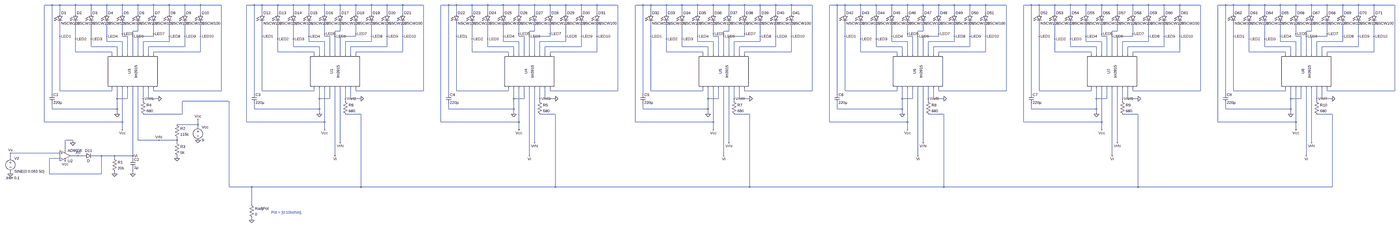
[diagram p0: schematic LM3915_Chain_Adj_Ground.asc, whole sheet]
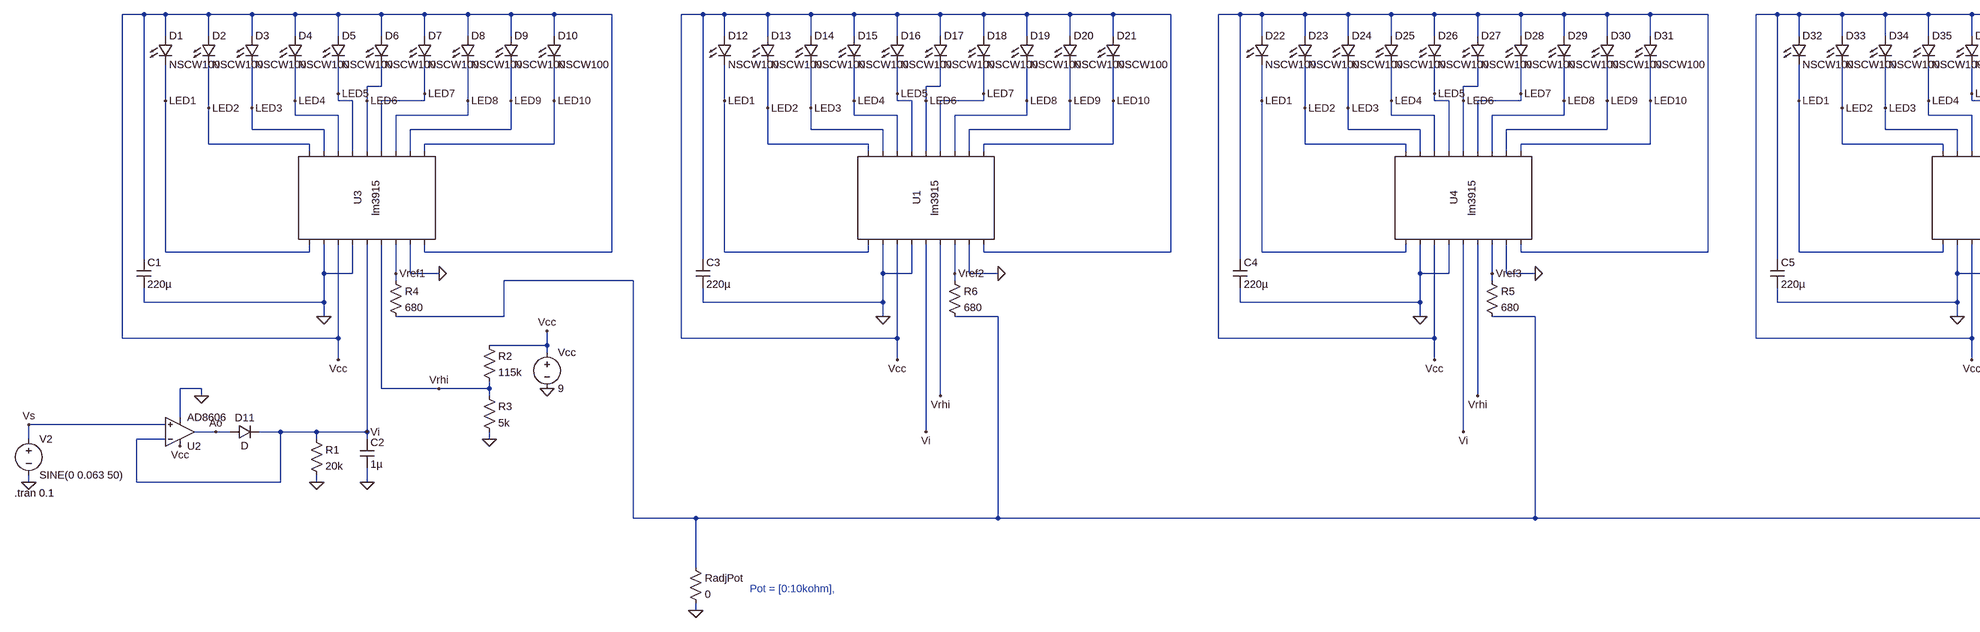
[diagram p1: schematic LM3915_Chain_Adj_Ground.asc, part, row 1 of 1, column 1 of 2]
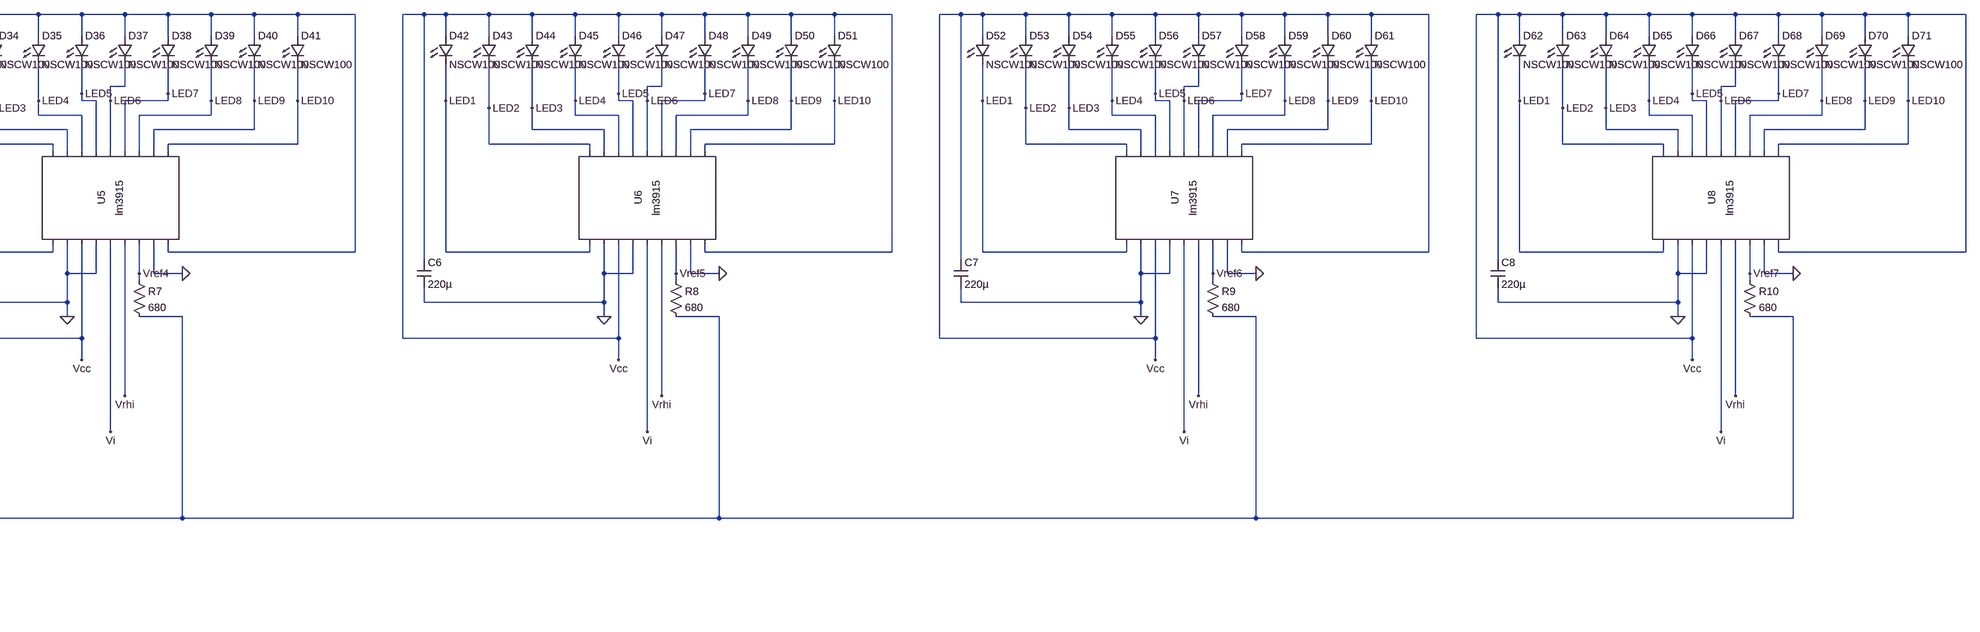
[diagram p2: schematic LM3915_Chain_Adj_Ground.asc, part, row 1 of 1, column 2 of 2]
LM3915_Chain_Adj_Ground.asc, the LTspice schematic file:
Version 4
SHEET 1 8612 680
WIRE -192 -832 -240 -832
WIRE -144 -832 -192 -832
WIRE -48 -832 -144 -832
WIRE 48 -832 -48 -832
WIRE 144 -832 48 -832
WIRE 240 -832 144 -832
WIRE 336 -832 240 -832
WIRE 432 -832 336 -832
WIRE 528 -832 432 -832
WIRE 624 -832 528 -832
WIRE 720 -832 624 -832
WIRE 848 -832 720 -832
WIRE 1104 -832 1056 -832
WIRE 1152 -832 1104 -832
WIRE 1248 -832 1152 -832
WIRE 1344 -832 1248 -832
WIRE 1440 -832 1344 -832
WIRE 1536 -832 1440 -832
WIRE 1632 -832 1536 -832
WIRE 1728 -832 1632 -832
WIRE 1824 -832 1728 -832
WIRE 1920 -832 1824 -832
WIRE 2016 -832 1920 -832
WIRE 2144 -832 2016 -832
WIRE 2400 -832 2352 -832
WIRE 2448 -832 2400 -832
WIRE 2544 -832 2448 -832
WIRE 2640 -832 2544 -832
WIRE 2736 -832 2640 -832
WIRE 2832 -832 2736 -832
WIRE 2928 -832 2832 -832
WIRE 3024 -832 2928 -832
WIRE 3120 -832 3024 -832
WIRE 3216 -832 3120 -832
WIRE 3312 -832 3216 -832
WIRE 3440 -832 3312 -832
WIRE 3696 -832 3648 -832
WIRE 3744 -832 3696 -832
WIRE 3840 -832 3744 -832
WIRE 3936 -832 3840 -832
WIRE 4032 -832 3936 -832
WIRE 4128 -832 4032 -832
WIRE 4224 -832 4128 -832
WIRE 4320 -832 4224 -832
WIRE 4416 -832 4320 -832
WIRE 4512 -832 4416 -832
WIRE 4608 -832 4512 -832
WIRE 4736 -832 4608 -832
WIRE 4976 -832 4928 -832
WIRE 5024 -832 4976 -832
WIRE 5120 -832 5024 -832
WIRE 5216 -832 5120 -832
WIRE 5312 -832 5216 -832
WIRE 5408 -832 5312 -832
WIRE 5504 -832 5408 -832
WIRE 5600 -832 5504 -832
WIRE 5696 -832 5600 -832
WIRE 5792 -832 5696 -832
WIRE 5888 -832 5792 -832
WIRE 6016 -832 5888 -832
WIRE 6256 -832 6208 -832
WIRE 6304 -832 6256 -832
WIRE 6400 -832 6304 -832
WIRE 6496 -832 6400 -832
WIRE 6592 -832 6496 -832
WIRE 6688 -832 6592 -832
WIRE 6784 -832 6688 -832
WIRE 6880 -832 6784 -832
WIRE 6976 -832 6880 -832
WIRE 7072 -832 6976 -832
WIRE 7168 -832 7072 -832
WIRE 7296 -832 7168 -832
WIRE 7568 -832 7520 -832
WIRE 7616 -832 7568 -832
WIRE 7712 -832 7616 -832
WIRE 7808 -832 7712 -832
WIRE 7904 -832 7808 -832
WIRE 8000 -832 7904 -832
WIRE 8096 -832 8000 -832
WIRE 8192 -832 8096 -832
WIRE 8288 -832 8192 -832
WIRE 8384 -832 8288 -832
WIRE 8480 -832 8384 -832
WIRE 8608 -832 8480 -832
WIRE -144 -784 -144 -832
WIRE -48 -784 -48 -832
WIRE 48 -784 48 -832
WIRE 144 -784 144 -832
WIRE 240 -784 240 -832
WIRE 336 -784 336 -832
WIRE 432 -784 432 -832
WIRE 528 -784 528 -832
WIRE 624 -784 624 -832
WIRE 720 -784 720 -832
WIRE 1152 -784 1152 -832
WIRE 1248 -784 1248 -832
WIRE 1344 -784 1344 -832
WIRE 1440 -784 1440 -832
WIRE 1536 -784 1536 -832
WIRE 1632 -784 1632 -832
WIRE 1728 -784 1728 -832
WIRE 1824 -784 1824 -832
WIRE 1920 -784 1920 -832
WIRE 2016 -784 2016 -832
WIRE 2448 -784 2448 -832
WIRE 2544 -784 2544 -832
WIRE 2640 -784 2640 -832
WIRE 2736 -784 2736 -832
WIRE 2832 -784 2832 -832
WIRE 2928 -784 2928 -832
WIRE 3024 -784 3024 -832
WIRE 3120 -784 3120 -832
WIRE 3216 -784 3216 -832
WIRE 3312 -784 3312 -832
WIRE 3744 -784 3744 -832
WIRE 3840 -784 3840 -832
WIRE 3936 -784 3936 -832
WIRE 4032 -784 4032 -832
WIRE 4128 -784 4128 -832
WIRE 4224 -784 4224 -832
WIRE 4320 -784 4320 -832
WIRE 4416 -784 4416 -832
WIRE 4512 -784 4512 -832
WIRE 4608 -784 4608 -832
WIRE 5024 -784 5024 -832
WIRE 5120 -784 5120 -832
WIRE 5216 -784 5216 -832
WIRE 5312 -784 5312 -832
WIRE 5408 -784 5408 -832
WIRE 5504 -784 5504 -832
WIRE 5600 -784 5600 -832
WIRE 5696 -784 5696 -832
WIRE 5792 -784 5792 -832
WIRE 5888 -784 5888 -832
WIRE 6304 -784 6304 -832
WIRE 6400 -784 6400 -832
WIRE 6496 -784 6496 -832
WIRE 6592 -784 6592 -832
WIRE 6688 -784 6688 -832
WIRE 6784 -784 6784 -832
WIRE 6880 -784 6880 -832
WIRE 6976 -784 6976 -832
WIRE 7072 -784 7072 -832
WIRE 7168 -784 7168 -832
WIRE 7616 -784 7616 -832
WIRE 7712 -784 7712 -832
WIRE 7808 -784 7808 -832
WIRE 7904 -784 7904 -832
WIRE 8000 -784 8000 -832
WIRE 8096 -784 8096 -832
WIRE 8192 -784 8192 -832
WIRE 8288 -784 8288 -832
WIRE 8384 -784 8384 -832
WIRE 8480 -784 8480 -832
WIRE 336 -672 336 -720
WIRE 336 -672 304 -672
WIRE 1632 -672 1632 -720
WIRE 1632 -672 1600 -672
WIRE 2928 -672 2928 -720
WIRE 2928 -672 2896 -672
WIRE 4224 -672 4224 -720
WIRE 4224 -672 4192 -672
WIRE 5504 -672 5504 -720
WIRE 5504 -672 5472 -672
WIRE 6784 -672 6784 -720
WIRE 6784 -672 6752 -672
WIRE 8096 -672 8096 -720
WIRE 8096 -672 8064 -672
WIRE 240 -656 240 -720
WIRE 432 -656 432 -720
WIRE 1536 -656 1536 -720
WIRE 1728 -656 1728 -720
WIRE 2832 -656 2832 -720
WIRE 3024 -656 3024 -720
WIRE 4128 -656 4128 -720
WIRE 4320 -656 4320 -720
WIRE 5408 -656 5408 -720
WIRE 5600 -656 5600 -720
WIRE 6688 -656 6688 -720
WIRE 6880 -656 6880 -720
WIRE 8000 -656 8000 -720
WIRE 8192 -656 8192 -720
WIRE -144 -640 -144 -720
WIRE 144 -640 144 -720
WIRE 240 -640 240 -656
WIRE 272 -640 240 -640
WIRE 304 -640 304 -672
WIRE 432 -640 432 -656
WIRE 432 -640 336 -640
WIRE 528 -640 528 -720
WIRE 624 -640 624 -720
WIRE 720 -640 720 -720
WIRE 1152 -640 1152 -720
WIRE 1440 -640 1440 -720
WIRE 1536 -640 1536 -656
WIRE 1568 -640 1536 -640
WIRE 1600 -640 1600 -672
WIRE 1728 -640 1728 -656
WIRE 1728 -640 1632 -640
WIRE 1824 -640 1824 -720
WIRE 1920 -640 1920 -720
WIRE 2016 -640 2016 -720
WIRE 2448 -640 2448 -720
WIRE 2736 -640 2736 -720
WIRE 2832 -640 2832 -656
WIRE 2864 -640 2832 -640
WIRE 2896 -640 2896 -672
WIRE 3024 -640 3024 -656
WIRE 3024 -640 2928 -640
WIRE 3120 -640 3120 -720
WIRE 3216 -640 3216 -720
WIRE 3312 -640 3312 -720
WIRE 3744 -640 3744 -720
WIRE 4032 -640 4032 -720
WIRE 4128 -640 4128 -656
WIRE 4160 -640 4128 -640
WIRE 4192 -640 4192 -672
WIRE 4320 -640 4320 -656
WIRE 4320 -640 4224 -640
WIRE 4416 -640 4416 -720
WIRE 4512 -640 4512 -720
WIRE 4608 -640 4608 -720
WIRE 5024 -640 5024 -720
WIRE 5312 -640 5312 -720
WIRE 5408 -640 5408 -656
WIRE 5440 -640 5408 -640
WIRE 5472 -640 5472 -672
WIRE 5600 -640 5600 -656
WIRE 5600 -640 5504 -640
WIRE 5696 -640 5696 -720
WIRE 5792 -640 5792 -720
WIRE 5888 -640 5888 -720
WIRE 6304 -640 6304 -720
WIRE 6592 -640 6592 -720
WIRE 6688 -640 6688 -656
WIRE 6720 -640 6688 -640
WIRE 6752 -640 6752 -672
WIRE 6880 -640 6880 -656
WIRE 6880 -640 6784 -640
WIRE 6976 -640 6976 -720
WIRE 7072 -640 7072 -720
WIRE 7168 -640 7168 -720
WIRE 7616 -640 7616 -720
WIRE 7904 -640 7904 -720
WIRE 8000 -640 8000 -656
WIRE 8032 -640 8000 -640
WIRE 8064 -640 8064 -672
WIRE 8192 -640 8192 -656
WIRE 8192 -640 8096 -640
WIRE 8288 -640 8288 -720
WIRE 8384 -640 8384 -720
WIRE 8480 -640 8480 -720
WIRE -48 -624 -48 -720
WIRE 48 -624 48 -720
WIRE 1248 -624 1248 -720
WIRE 1344 -624 1344 -720
WIRE 2544 -624 2544 -720
WIRE 2640 -624 2640 -720
WIRE 3840 -624 3840 -720
WIRE 3936 -624 3936 -720
WIRE 5120 -624 5120 -720
WIRE 5216 -624 5216 -720
WIRE 6400 -624 6400 -720
WIRE 6496 -624 6496 -720
WIRE 7712 -624 7712 -720
WIRE 7808 -624 7808 -720
WIRE 144 -608 144 -640
WIRE 240 -608 144 -608
WIRE 528 -608 528 -640
WIRE 528 -608 368 -608
WIRE 1440 -608 1440 -640
WIRE 1536 -608 1440 -608
WIRE 1824 -608 1824 -640
WIRE 1824 -608 1664 -608
WIRE 2736 -608 2736 -640
WIRE 2832 -608 2736 -608
WIRE 3120 -608 3120 -640
WIRE 3120 -608 2960 -608
WIRE 4032 -608 4032 -640
WIRE 4128 -608 4032 -608
WIRE 4416 -608 4416 -640
WIRE 4416 -608 4256 -608
WIRE 5312 -608 5312 -640
WIRE 5408 -608 5312 -608
WIRE 5696 -608 5696 -640
WIRE 5696 -608 5536 -608
WIRE 6592 -608 6592 -640
WIRE 6688 -608 6592 -608
WIRE 6976 -608 6976 -640
WIRE 6976 -608 6816 -608
WIRE 7904 -608 7904 -640
WIRE 8000 -608 7904 -608
WIRE 8288 -608 8288 -640
WIRE 8288 -608 8128 -608
WIRE 48 -576 48 -624
WIRE 208 -576 48 -576
WIRE 624 -576 624 -640
WIRE 624 -576 400 -576
WIRE 1344 -576 1344 -624
WIRE 1504 -576 1344 -576
WIRE 1920 -576 1920 -640
WIRE 1920 -576 1696 -576
WIRE 2640 -576 2640 -624
WIRE 2800 -576 2640 -576
WIRE 3216 -576 3216 -640
WIRE 3216 -576 2992 -576
WIRE 3936 -576 3936 -624
WIRE 4096 -576 3936 -576
WIRE 4512 -576 4512 -640
WIRE 4512 -576 4288 -576
WIRE 5216 -576 5216 -624
WIRE 5376 -576 5216 -576
WIRE 5792 -576 5792 -640
WIRE 5792 -576 5568 -576
WIRE 6496 -576 6496 -624
WIRE 6656 -576 6496 -576
WIRE 7072 -576 7072 -640
WIRE 7072 -576 6848 -576
WIRE 7808 -576 7808 -624
WIRE 7968 -576 7808 -576
WIRE 8384 -576 8384 -640
WIRE 8384 -576 8160 -576
WIRE -48 -544 -48 -624
WIRE 176 -544 -48 -544
WIRE 720 -544 720 -640
WIRE 720 -544 432 -544
WIRE 1248 -544 1248 -624
WIRE 1472 -544 1248 -544
WIRE 2016 -544 2016 -640
WIRE 2016 -544 1728 -544
WIRE 2544 -544 2544 -624
WIRE 2768 -544 2544 -544
WIRE 3312 -544 3312 -640
WIRE 3312 -544 3024 -544
WIRE 3840 -544 3840 -624
WIRE 4064 -544 3840 -544
WIRE 4608 -544 4608 -640
WIRE 4608 -544 4320 -544
WIRE 5120 -544 5120 -624
WIRE 5344 -544 5120 -544
WIRE 5888 -544 5888 -640
WIRE 5888 -544 5600 -544
WIRE 6400 -544 6400 -624
WIRE 6624 -544 6400 -544
WIRE 7168 -544 7168 -640
WIRE 7168 -544 6880 -544
WIRE 7712 -544 7712 -624
WIRE 7936 -544 7712 -544
WIRE 8480 -544 8480 -640
WIRE 8480 -544 8192 -544
WIRE 176 -528 176 -544
WIRE 208 -528 208 -576
WIRE 240 -528 240 -608
WIRE 272 -528 272 -640
WIRE 304 -528 304 -640
WIRE 336 -528 336 -640
WIRE 368 -528 368 -608
WIRE 400 -528 400 -576
WIRE 432 -528 432 -544
WIRE 1472 -528 1472 -544
WIRE 1504 -528 1504 -576
WIRE 1536 -528 1536 -608
WIRE 1568 -528 1568 -640
WIRE 1600 -528 1600 -640
WIRE 1632 -528 1632 -640
WIRE 1664 -528 1664 -608
WIRE 1696 -528 1696 -576
WIRE 1728 -528 1728 -544
WIRE 2768 -528 2768 -544
WIRE 2800 -528 2800 -576
WIRE 2832 -528 2832 -608
WIRE 2864 -528 2864 -640
WIRE 2896 -528 2896 -640
WIRE 2928 -528 2928 -640
WIRE 2960 -528 2960 -608
WIRE 2992 -528 2992 -576
WIRE 3024 -528 3024 -544
WIRE 4064 -528 4064 -544
WIRE 4096 -528 4096 -576
WIRE 4128 -528 4128 -608
WIRE 4160 -528 4160 -640
WIRE 4192 -528 4192 -640
WIRE 4224 -528 4224 -640
WIRE 4256 -528 4256 -608
WIRE 4288 -528 4288 -576
WIRE 4320 -528 4320 -544
WIRE 5344 -528 5344 -544
WIRE 5376 -528 5376 -576
WIRE 5408 -528 5408 -608
WIRE 5440 -528 5440 -640
WIRE 5472 -528 5472 -640
WIRE 5504 -528 5504 -640
WIRE 5536 -528 5536 -608
WIRE 5568 -528 5568 -576
WIRE 5600 -528 5600 -544
WIRE 6624 -528 6624 -544
WIRE 6656 -528 6656 -576
WIRE 6688 -528 6688 -608
WIRE 6720 -528 6720 -640
WIRE 6752 -528 6752 -640
WIRE 6784 -528 6784 -640
WIRE 6816 -528 6816 -608
WIRE 6848 -528 6848 -576
WIRE 6880 -528 6880 -544
WIRE 7936 -528 7936 -544
WIRE 7968 -528 7968 -576
WIRE 8000 -528 8000 -608
WIRE 8032 -528 8032 -640
WIRE 8064 -528 8064 -640
WIRE 8096 -528 8096 -640
WIRE 8128 -528 8128 -608
WIRE 8160 -528 8160 -576
WIRE 8192 -528 8192 -544
WIRE -144 -304 -144 -640
WIRE 176 -304 176 -320
WIRE 176 -304 -144 -304
WIRE 432 -304 432 -320
WIRE 848 -304 848 -832
WIRE 848 -304 432 -304
WIRE 1152 -304 1152 -640
WIRE 1472 -304 1472 -320
WIRE 1472 -304 1152 -304
WIRE 1728 -304 1728 -320
WIRE 2144 -304 2144 -832
WIRE 2144 -304 1728 -304
WIRE 2448 -304 2448 -640
WIRE 2768 -304 2768 -320
WIRE 2768 -304 2448 -304
WIRE 3024 -304 3024 -320
WIRE 3440 -304 3440 -832
WIRE 3440 -304 3024 -304
WIRE 3744 -304 3744 -640
WIRE 4064 -304 4064 -320
WIRE 4064 -304 3744 -304
WIRE 4320 -304 4320 -320
WIRE 4736 -304 4736 -832
WIRE 4736 -304 4320 -304
WIRE 5024 -304 5024 -640
WIRE 5344 -304 5344 -320
WIRE 5344 -304 5024 -304
WIRE 5600 -304 5600 -320
WIRE 6016 -304 6016 -832
WIRE 6016 -304 5600 -304
WIRE 6304 -304 6304 -640
WIRE 6624 -304 6624 -320
WIRE 6624 -304 6304 -304
WIRE 6880 -304 6880 -320
WIRE 7296 -304 7296 -832
WIRE 7296 -304 6880 -304
WIRE 7616 -304 7616 -640
WIRE 7936 -304 7936 -320
WIRE 7936 -304 7616 -304
WIRE 8192 -304 8192 -320
WIRE 8608 -304 8608 -832
WIRE 8608 -304 8192 -304
WIRE -192 -288 -192 -832
WIRE 1104 -288 1104 -832
WIRE 2400 -288 2400 -832
WIRE 3696 -288 3696 -832
WIRE 4976 -288 4976 -832
WIRE 6256 -288 6256 -832
WIRE 7568 -288 7568 -832
WIRE 208 -256 208 -320
WIRE 272 -256 272 -320
WIRE 272 -256 208 -256
WIRE 368 -256 368 -320
WIRE 400 -256 400 -320
WIRE 464 -256 400 -256
WIRE 1504 -256 1504 -320
WIRE 1568 -256 1568 -320
WIRE 1568 -256 1504 -256
WIRE 1664 -256 1664 -320
WIRE 1696 -256 1696 -320
WIRE 1760 -256 1696 -256
WIRE 2800 -256 2800 -320
WIRE 2864 -256 2864 -320
WIRE 2864 -256 2800 -256
WIRE 2960 -256 2960 -320
WIRE 2992 -256 2992 -320
WIRE 3056 -256 2992 -256
WIRE 4096 -256 4096 -320
WIRE 4160 -256 4160 -320
WIRE 4160 -256 4096 -256
WIRE 4256 -256 4256 -320
WIRE 4288 -256 4288 -320
WIRE 4352 -256 4288 -256
WIRE 5376 -256 5376 -320
WIRE 5440 -256 5440 -320
WIRE 5440 -256 5376 -256
WIRE 5536 -256 5536 -320
WIRE 5568 -256 5568 -320
WIRE 5632 -256 5568 -256
WIRE 6656 -256 6656 -320
WIRE 6720 -256 6720 -320
WIRE 6720 -256 6656 -256
WIRE 6816 -256 6816 -320
WIRE 6848 -256 6848 -320
WIRE 6912 -256 6848 -256
WIRE 7968 -256 7968 -320
WIRE 8032 -256 8032 -320
WIRE 8032 -256 7968 -256
WIRE 8128 -256 8128 -320
WIRE 8160 -256 8160 -320
WIRE 8224 -256 8160 -256
WIRE 368 -240 368 -256
WIRE 896 -240 608 -240
WIRE 1664 -240 1664 -256
WIRE 2960 -240 2960 -256
WIRE 4256 -240 4256 -256
WIRE 5536 -240 5536 -256
WIRE 6816 -240 6816 -256
WIRE 8128 -240 8128 -256
WIRE -192 -192 -192 -224
WIRE 208 -192 208 -256
WIRE 208 -192 -192 -192
WIRE 1104 -192 1104 -224
WIRE 1504 -192 1504 -256
WIRE 1504 -192 1104 -192
WIRE 2400 -192 2400 -224
WIRE 2800 -192 2800 -256
WIRE 2800 -192 2400 -192
WIRE 3696 -192 3696 -224
WIRE 4096 -192 4096 -256
WIRE 4096 -192 3696 -192
WIRE 4976 -192 4976 -224
WIRE 5376 -192 5376 -256
WIRE 5376 -192 4976 -192
WIRE 6256 -192 6256 -224
WIRE 6656 -192 6656 -256
WIRE 6656 -192 6256 -192
WIRE 7568 -192 7568 -224
WIRE 7968 -192 7968 -256
WIRE 7968 -192 7568 -192
WIRE 208 -160 208 -192
WIRE 608 -160 608 -240
WIRE 608 -160 368 -160
WIRE 1504 -160 1504 -192
WIRE 1760 -160 1664 -160
WIRE 2800 -160 2800 -192
WIRE 3056 -160 2960 -160
WIRE 4096 -160 4096 -192
WIRE 4352 -160 4256 -160
WIRE 5376 -160 5376 -192
WIRE 5632 -160 5536 -160
WIRE 6656 -160 6656 -192
WIRE 6912 -160 6816 -160
WIRE 7968 -160 7968 -192
WIRE 8224 -160 8128 -160
WIRE -240 -112 -240 -832
WIRE 240 -112 240 -320
WIRE 240 -112 -240 -112
WIRE 1056 -112 1056 -832
WIRE 1536 -112 1536 -320
WIRE 1536 -112 1056 -112
WIRE 2352 -112 2352 -832
WIRE 2832 -112 2832 -320
WIRE 2832 -112 2352 -112
WIRE 3648 -112 3648 -832
WIRE 4128 -112 4128 -320
WIRE 4128 -112 3648 -112
WIRE 4928 -112 4928 -832
WIRE 5408 -112 5408 -320
WIRE 5408 -112 4928 -112
WIRE 6208 -112 6208 -832
WIRE 6688 -112 6688 -320
WIRE 6688 -112 6208 -112
WIRE 7520 -112 7520 -832
WIRE 8000 -112 8000 -320
WIRE 8000 -112 7520 -112
WIRE 704 -96 704 -128
WIRE 704 -96 576 -96
WIRE 704 -80 704 -96
WIRE 240 -64 240 -112
WIRE 1536 -64 1536 -112
WIRE 2832 -64 2832 -112
WIRE 4128 -64 4128 -112
WIRE 5408 -64 5408 -112
WIRE 6688 -64 6688 -112
WIRE 8000 -64 8000 -112
WIRE -64 0 -112 0
WIRE 336 0 336 -320
WIRE 464 0 336 0
WIRE 576 0 576 -16
WIRE 576 0 464 0
WIRE -64 16 -64 0
WIRE 576 16 576 0
WIRE 1632 16 1632 -320
WIRE 2928 16 2928 -320
WIRE 4224 16 4224 -320
WIRE 5504 16 5504 -320
WIRE 6784 16 6784 -320
WIRE 8096 16 8096 -320
WIRE -112 64 -112 0
WIRE -144 80 -448 80
WIRE -32 96 -80 96
WIRE 0 96 -32 96
WIRE 112 96 64 96
WIRE 192 96 112 96
WIRE 304 96 304 -320
WIRE 304 96 192 96
WIRE 1600 96 1600 -320
WIRE 2896 96 2896 -320
WIRE 4192 96 4192 -320
WIRE 5472 96 5472 -320
WIRE 6752 96 6752 -320
WIRE 8064 96 8064 -320
WIRE -448 112 -448 80
WIRE -144 112 -208 112
WIRE 192 112 192 96
WIRE 304 112 304 96
WIRE 576 112 576 96
WIRE -448 208 -448 192
WIRE -208 208 -208 112
WIRE 112 208 112 96
WIRE 112 208 -208 208
WIRE 192 208 192 192
WIRE 304 208 304 176
WIRE 896 288 896 -240
WIRE 1088 288 896 288
WIRE 1760 288 1760 -160
WIRE 1760 288 1088 288
WIRE 3056 288 3056 -160
WIRE 3056 288 1760 288
WIRE 4352 288 4352 -160
WIRE 4352 288 3056 288
WIRE 5632 288 5632 -160
WIRE 5632 288 4352 288
WIRE 6912 288 6912 -160
WIRE 6912 288 5632 288
WIRE 8224 288 8224 -160
WIRE 8224 288 6912 288
WIRE 1088 432 1088 288
WIRE 1088 528 1088 512
FLAG 208 -160 0
FLAG 704 0 0
FLAG -112 128 Vcc
FLAG -448 208 0
FLAG 192 208 0
FLAG -448 80 Vs
FLAG 704 -128 Vcc
FLAG -32 96 Ao
FLAG -64 16 0
FLAG 304 208 0
FLAG 304 96 Vi
FLAG 576 112 0
FLAG 240 -64 Vcc
FLAG -144 -640 LED1
FLAG -48 -624 LED2
FLAG 48 -624 LED3
FLAG 144 -640 LED4
FLAG 240 -656 LED5
FLAG 304 -640 LED6
FLAG 432 -656 LED7
FLAG 528 -640 LED8
FLAG 624 -640 LED9
FLAG 720 -640 LED10
FLAG 368 -256 Vref1
FLAG 464 0 Vrhi
FLAG 1504 -160 0
FLAG 1536 -64 Vcc
FLAG 1152 -640 LED1
FLAG 1248 -624 LED2
FLAG 1344 -624 LED3
FLAG 1440 -640 LED4
FLAG 1536 -656 LED5
FLAG 1600 -640 LED6
FLAG 1728 -656 LED7
FLAG 1824 -640 LED8
FLAG 1920 -640 LED9
FLAG 2016 -640 LED10
FLAG 1664 -256 Vref2
FLAG 1632 16 Vrhi
FLAG 1600 96 Vi
FLAG 2800 -160 0
FLAG 2832 -64 Vcc
FLAG 2448 -640 LED1
FLAG 2544 -624 LED2
FLAG 2640 -624 LED3
FLAG 2736 -640 LED4
FLAG 2832 -656 LED5
FLAG 2896 -640 LED6
FLAG 3024 -656 LED7
FLAG 3120 -640 LED8
FLAG 3216 -640 LED9
FLAG 3312 -640 LED10
FLAG 2960 -256 Vref3
FLAG 2928 16 Vrhi
FLAG 2896 96 Vi
FLAG 4096 -160 0
FLAG 4128 -64 Vcc
FLAG 3744 -640 LED1
FLAG 3840 -624 LED2
FLAG 3936 -624 LED3
FLAG 4032 -640 LED4
FLAG 4128 -656 LED5
FLAG 4192 -640 LED6
FLAG 4320 -656 LED7
FLAG 4416 -640 LED8
FLAG 4512 -640 LED9
FLAG 4608 -640 LED10
FLAG 4256 -256 Vref4
FLAG 4224 16 Vrhi
FLAG 4192 96 Vi
FLAG 5376 -160 0
FLAG 5408 -64 Vcc
FLAG 5024 -640 LED1
FLAG 5120 -624 LED2
FLAG 5216 -624 LED3
FLAG 5312 -640 LED4
FLAG 5408 -656 LED5
FLAG 5472 -640 LED6
FLAG 5600 -656 LED7
FLAG 5696 -640 LED8
FLAG 5792 -640 LED9
FLAG 5888 -640 LED10
FLAG 5536 -256 Vref5
FLAG 5504 16 Vrhi
FLAG 5472 96 Vi
FLAG 6656 -160 0
FLAG 6688 -64 Vcc
FLAG 6304 -640 LED1
FLAG 6400 -624 LED2
FLAG 6496 -624 LED3
FLAG 6592 -640 LED4
FLAG 6688 -656 LED5
FLAG 6752 -640 LED6
FLAG 6880 -656 LED7
FLAG 6976 -640 LED8
FLAG 7072 -640 LED9
FLAG 7168 -640 LED10
FLAG 6816 -256 Vref6
FLAG 6784 16 Vrhi
FLAG 6752 96 Vi
FLAG 7968 -160 0
FLAG 8000 -64 Vcc
FLAG 7616 -640 LED1
FLAG 7712 -624 LED2
FLAG 7808 -624 LED3
FLAG 7904 -640 LED4
FLAG 8000 -656 LED5
FLAG 8064 -640 LED6
FLAG 8192 -656 LED7
FLAG 8288 -640 LED8
FLAG 8384 -640 LED9
FLAG 8480 -640 LED10
FLAG 8128 -256 Vref7
FLAG 8096 16 Vrhi
FLAG 8064 96 Vi
FLAG 1088 528 0
FLAG 464 -256 0
FLAG 1760 -256 0
FLAG 3056 -256 0
FLAG 4352 -256 0
FLAG 5632 -256 0
FLAG 6912 -256 0
FLAG 8224 -256 0
SYMBOL LED -160 -784 R0
SYMATTR InstName D1
SYMATTR Value NSCW100
SYMBOL LED -64 -784 R0
SYMATTR InstName D2
SYMATTR Value NSCW100
SYMBOL LED 32 -784 R0
SYMATTR InstName D3
SYMATTR Value NSCW100
SYMBOL LED 128 -784 R0
SYMATTR InstName D4
SYMATTR Value NSCW100
SYMBOL LED 224 -784 R0
SYMATTR InstName D5
SYMATTR Value NSCW100
SYMBOL LED 320 -784 R0
SYMATTR InstName D6
SYMATTR Value NSCW100
SYMBOL LED 416 -784 R0
SYMATTR InstName D7
SYMATTR Value NSCW100
SYMBOL LED 512 -784 R0
SYMATTR InstName D8
SYMATTR Value NSCW100
SYMBOL LED 608 -784 R0
SYMATTR InstName D9
SYMATTR Value NSCW100
SYMBOL LED 704 -784 R0
SYMATTR InstName D10
SYMATTR Value NSCW100
SYMBOL cap -208 -288 R0
SYMATTR InstName C1
SYMATTR Value 220µ
SYMBOL voltage 704 -96 R0
WINDOW 123 0 0 Left 0
WINDOW 39 0 0 Left 0
SYMATTR InstName Vcc
SYMATTR Value 9
SYMBOL voltage -448 96 R0
WINDOW 123 0 0 Left 0
WINDOW 39 0 0 Left 0
SYMATTR InstName V2
SYMATTR Value SINE(0 0.063 50)
SYMBOL res 176 96 R0
SYMATTR InstName R1
SYMATTR Value 20k
SYMBOL diode 0 112 R270
WINDOW 0 32 32 VTop 2
WINDOW 3 0 32 VBottom 2
SYMATTR InstName D11
SYMBOL OpAmps\\AD8606 -112 160 M180
SYMATTR InstName U2
SYMBOL cap 288 112 R0
SYMATTR InstName C2
SYMATTR Value 1µ
SYMBOL AutoGenerated\\lm3915 304 -416 R270
SYMATTR InstName U3
SYMBOL res 560 -112 R0
SYMATTR InstName R2
SYMATTR Value 115k
SYMBOL res 560 0 R0
SYMATTR InstName R3
SYMATTR Value 5k
SYMBOL res 352 -256 R0
SYMATTR InstName R4
SYMATTR Value 680
SYMBOL LED 1136 -784 R0
SYMATTR InstName D12
SYMATTR Value NSCW100
SYMBOL LED 1232 -784 R0
SYMATTR InstName D13
SYMATTR Value NSCW100
SYMBOL LED 1328 -784 R0
SYMATTR InstName D14
SYMATTR Value NSCW100
SYMBOL LED 1424 -784 R0
SYMATTR InstName D15
SYMATTR Value NSCW100
SYMBOL LED 1520 -784 R0
SYMATTR InstName D16
SYMATTR Value NSCW100
SYMBOL LED 1616 -784 R0
SYMATTR InstName D17
SYMATTR Value NSCW100
SYMBOL LED 1712 -784 R0
SYMATTR InstName D18
SYMATTR Value NSCW100
SYMBOL LED 1808 -784 R0
SYMATTR InstName D19
SYMATTR Value NSCW100
SYMBOL LED 1904 -784 R0
SYMATTR InstName D20
SYMATTR Value NSCW100
SYMBOL LED 2000 -784 R0
SYMATTR InstName D21
SYMATTR Value NSCW100
SYMBOL cap 1088 -288 R0
SYMATTR InstName C3
SYMATTR Value 220µ
SYMBOL AutoGenerated\\lm3915 1600 -416 R270
SYMATTR InstName U1
SYMBOL res 1648 -256 R0
SYMATTR InstName R6
SYMATTR Value 680
SYMBOL LED 2432 -784 R0
SYMATTR InstName D22
SYMATTR Value NSCW100
SYMBOL LED 2528 -784 R0
SYMATTR InstName D23
SYMATTR Value NSCW100
SYMBOL LED 2624 -784 R0
SYMATTR InstName D24
SYMATTR Value NSCW100
SYMBOL LED 2720 -784 R0
SYMATTR InstName D25
SYMATTR Value NSCW100
SYMBOL LED 2816 -784 R0
SYMATTR InstName D26
SYMATTR Value NSCW100
SYMBOL LED 2912 -784 R0
SYMATTR InstName D27
SYMATTR Value NSCW100
SYMBOL LED 3008 -784 R0
SYMATTR InstName D28
SYMATTR Value NSCW100
SYMBOL LED 3104 -784 R0
SYMATTR InstName D29
SYMATTR Value NSCW100
SYMBOL LED 3200 -784 R0
SYMATTR InstName D30
SYMATTR Value NSCW100
SYMBOL LED 3296 -784 R0
SYMATTR InstName D31
SYMATTR Value NSCW100
SYMBOL cap 2384 -288 R0
SYMATTR InstName C4
SYMATTR Value 220µ
SYMBOL AutoGenerated\\lm3915 2896 -416 R270
SYMATTR InstName U4
SYMBOL res 2944 -256 R0
SYMATTR InstName R5
SYMATTR Value 680
SYMBOL LED 3728 -784 R0
SYMATTR InstName D32
SYMATTR Value NSCW100
SYMBOL LED 3824 -784 R0
SYMATTR InstName D33
SYMATTR Value NSCW100
SYMBOL LED 3920 -784 R0
SYMATTR InstName D34
SYMATTR Value NSCW100
SYMBOL LED 4016 -784 R0
SYMATTR InstName D35
SYMATTR Value NSCW100
SYMBOL LED 4112 -784 R0
SYMATTR InstName D36
SYMATTR Value NSCW100
SYMBOL LED 4208 -784 R0
SYMATTR InstName D37
SYMATTR Value NSCW100
SYMBOL LED 4304 -784 R0
SYMATTR InstName D38
SYMATTR Value NSCW100
SYMBOL LED 4400 -784 R0
SYMATTR InstName D39
SYMATTR Value NSCW100
SYMBOL LED 4496 -784 R0
SYMATTR InstName D40
SYMATTR Value NSCW100
SYMBOL LED 4592 -784 R0
SYMATTR InstName D41
SYMATTR Value NSCW100
SYMBOL cap 3680 -288 R0
SYMATTR InstName C5
SYMATTR Value 220µ
SYMBOL AutoGenerated\\lm3915 4192 -416 R270
SYMATTR InstName U5
SYMBOL res 4240 -256 R0
SYMATTR InstName R7
SYMATTR Value 680
SYMBOL LED 5008 -784 R0
SYMATTR InstName D42
SYMATTR Value NSCW100
SYMBOL LED 5104 -784 R0
SYMATTR InstName D43
SYMATTR Value NSCW100
SYMBOL LED 5200 -784 R0
SYMATTR InstName D44
SYMATTR Value NSCW100
SYMBOL LED 5296 -784 R0
SYMATTR InstName D45
SYMATTR Value NSCW100
SYMBOL LED 5392 -784 R0
SYMATTR InstName D46
SYMATTR Value NSCW100
SYMBOL LED 5488 -784 R0
SYMATTR InstName D47
SYMATTR Value NSCW100
SYMBOL LED 5584 -784 R0
SYMATTR InstName D48
SYMATTR Value NSCW100
SYMBOL LED 5680 -784 R0
SYMATTR InstName D49
SYMATTR Value NSCW100
SYMBOL LED 5776 -784 R0
SYMATTR InstName D50
SYMATTR Value NSCW100
SYMBOL LED 5872 -784 R0
SYMATTR InstName D51
SYMATTR Value NSCW100
SYMBOL cap 4960 -288 R0
SYMATTR InstName C6
SYMATTR Value 220µ
SYMBOL AutoGenerated\\lm3915 5472 -416 R270
SYMATTR InstName U6
SYMBOL res 5520 -256 R0
SYMATTR InstName R8
SYMATTR Value 680
SYMBOL LED 6288 -784 R0
SYMATTR InstName D52
SYMATTR Value NSCW100
SYMBOL LED 6384 -784 R0
SYMATTR InstName D53
SYMATTR Value NSCW100
SYMBOL LED 6480 -784 R0
SYMATTR InstName D54
SYMATTR Value NSCW100
SYMBOL LED 6576 -784 R0
SYMATTR InstName D55
SYMATTR Value NSCW100
SYMBOL LED 6672 -784 R0
SYMATTR InstName D56
SYMATTR Value NSCW100
SYMBOL LED 6768 -784 R0
SYMATTR InstName D57
SYMATTR Value NSCW100
SYMBOL LED 6864 -784 R0
SYMATTR InstName D58
SYMATTR Value NSCW100
SYMBOL LED 6960 -784 R0
SYMATTR InstName D59
SYMATTR Value NSCW100
SYMBOL LED 7056 -784 R0
SYMATTR InstName D60
SYMATTR Value NSCW100
SYMBOL LED 7152 -784 R0
SYMATTR InstName D61
SYMATTR Value NSCW100
SYMBOL cap 6240 -288 R0
SYMATTR InstName C7
SYMATTR Value 220µ
SYMBOL AutoGenerated\\lm3915 6752 -416 R270
SYMATTR InstName U7
SYMBOL res 6800 -256 R0
SYMATTR InstName R9
SYMATTR Value 680
SYMBOL LED 7600 -784 R0
SYMATTR InstName D62
SYMATTR Value NSCW100
SYMBOL LED 7696 -784 R0
SYMATTR InstName D63
SYMATTR Value NSCW100
SYMBOL LED 7792 -784 R0
SYMATTR InstName D64
SYMATTR Value NSCW100
SYMBOL LED 7888 -784 R0
SYMATTR InstName D65
SYMATTR Value NSCW100
SYMBOL LED 7984 -784 R0
SYMATTR InstName D66
SYMATTR Value NSCW100
SYMBOL LED 8080 -784 R0
SYMATTR InstName D67
SYMATTR Value NSCW100
SYMBOL LED 8176 -784 R0
SYMATTR InstName D68
SYMATTR Value NSCW100
SYMBOL LED 8272 -784 R0
SYMATTR InstName D69
SYMATTR Value NSCW100
SYMBOL LED 8368 -784 R0
SYMATTR InstName D70
SYMATTR Value NSCW100
SYMBOL LED 8464 -784 R0
SYMATTR InstName D71
SYMATTR Value NSCW100
SYMBOL cap 7552 -288 R0
SYMATTR InstName C8
SYMATTR Value 220µ
SYMBOL AutoGenerated\\lm3915 8064 -416 R270
SYMATTR InstName U8
SYMBOL res 8112 -256 R0
SYMATTR InstName R10
SYMATTR Value 680
SYMBOL res 1072 416 R0
SYMATTR InstName RadjPot
SYMATTR Value 0
TEXT -480 232 Left 2 !.tran 0.1
TEXT 1208 480 Left 2 ;Pot = [0:10kohm],

The netlist it stands for:
* LM3915_Chain_Adj_Ground.asc
D1 Vcc LED1 NSCW100
D2 Vcc LED2 NSCW100
D3 Vcc LED3 NSCW100
D4 Vcc LED4 NSCW100
D5 Vcc LED5 NSCW100
D6 Vcc LED6 NSCW100
D7 Vcc LED7 NSCW100
D8 Vcc LED8 NSCW100
D9 Vcc LED9 NSCW100
D10 Vcc LED10 NSCW100
C1 Vcc 0 220µ
Vcc Vcc 0 9
V2 Vs 0 SINE(0 0.063 50)
R1 Vi 0 20k
D11 Ao Vi D
XU2 Vs Vi Vcc 0 Ao AD8606  ; pins In+ In- V+ V- OUT
C2 Vi 0 1µ
* U3: lm3915 (symbol AutoGenerated\lm3915 not available, pins judged from their places): pin1=LED1 pin2=0 pin3=Vcc pin4=0 pin5=Vi pin6=Vrhi pin7=Vref1 pin8=0 pin9=Vcc pin10=LED2 pin11=LED3 pin12=LED4 pin13=LED5 pin14=LED6 pin15=LED7 pin16=LED8 pin17=LED9 pin18=LED10
R2 Vcc Vrhi 115k
R3 Vrhi 0 5k
R4 Vref1 N001 680
D12 Vcc LED1 NSCW100
D13 Vcc LED2 NSCW100
D14 Vcc LED3 NSCW100
D15 Vcc LED4 NSCW100
D16 Vcc LED5 NSCW100
D17 Vcc LED6 NSCW100
D18 Vcc LED7 NSCW100
D19 Vcc LED8 NSCW100
D20 Vcc LED9 NSCW100
D21 Vcc LED10 NSCW100
C3 Vcc 0 220µ
* U1: lm3915 (symbol AutoGenerated\lm3915 not available, pins judged from their places): pin1=LED1 pin2=0 pin3=Vcc pin4=0 pin5=Vi pin6=Vrhi pin7=Vref2 pin8=0 pin9=Vcc pin10=LED2 pin11=LED3 pin12=LED4 pin13=LED5 pin14=LED6 pin15=LED7 pin16=LED8 pin17=LED9 pin18=LED10
R6 Vref2 N001 680
D22 Vcc LED1 NSCW100
D23 Vcc LED2 NSCW100
D24 Vcc LED3 NSCW100
D25 Vcc LED4 NSCW100
D26 Vcc LED5 NSCW100
D27 Vcc LED6 NSCW100
D28 Vcc LED7 NSCW100
D29 Vcc LED8 NSCW100
D30 Vcc LED9 NSCW100
D31 Vcc LED10 NSCW100
C4 Vcc 0 220µ
* U4: lm3915 (symbol AutoGenerated\lm3915 not available, pins judged from their places): pin1=LED1 pin2=0 pin3=Vcc pin4=0 pin5=Vi pin6=Vrhi pin7=Vref3 pin8=0 pin9=Vcc pin10=LED2 pin11=LED3 pin12=LED4 pin13=LED5 pin14=LED6 pin15=LED7 pin16=LED8 pin17=LED9 pin18=LED10
R5 Vref3 N001 680
D32 Vcc LED1 NSCW100
D33 Vcc LED2 NSCW100
D34 Vcc LED3 NSCW100
D35 Vcc LED4 NSCW100
D36 Vcc LED5 NSCW100
D37 Vcc LED6 NSCW100
D38 Vcc LED7 NSCW100
D39 Vcc LED8 NSCW100
D40 Vcc LED9 NSCW100
D41 Vcc LED10 NSCW100
C5 Vcc 0 220µ
* U5: lm3915 (symbol AutoGenerated\lm3915 not available, pins judged from their places): pin1=LED1 pin2=0 pin3=Vcc pin4=0 pin5=Vi pin6=Vrhi pin7=Vref4 pin8=0 pin9=Vcc pin10=LED2 pin11=LED3 pin12=LED4 pin13=LED5 pin14=LED6 pin15=LED7 pin16=LED8 pin17=LED9 pin18=LED10
R7 Vref4 N001 680
D42 Vcc LED1 NSCW100
D43 Vcc LED2 NSCW100
D44 Vcc LED3 NSCW100
D45 Vcc LED4 NSCW100
D46 Vcc LED5 NSCW100
D47 Vcc LED6 NSCW100
D48 Vcc LED7 NSCW100
D49 Vcc LED8 NSCW100
D50 Vcc LED9 NSCW100
D51 Vcc LED10 NSCW100
C6 Vcc 0 220µ
* U6: lm3915 (symbol AutoGenerated\lm3915 not available, pins judged from their places): pin1=LED1 pin2=0 pin3=Vcc pin4=0 pin5=Vi pin6=Vrhi pin7=Vref5 pin8=0 pin9=Vcc pin10=LED2 pin11=LED3 pin12=LED4 pin13=LED5 pin14=LED6 pin15=LED7 pin16=LED8 pin17=LED9 pin18=LED10
R8 Vref5 N001 680
D52 Vcc LED1 NSCW100
D53 Vcc LED2 NSCW100
D54 Vcc LED3 NSCW100
D55 Vcc LED4 NSCW100
D56 Vcc LED5 NSCW100
D57 Vcc LED6 NSCW100
D58 Vcc LED7 NSCW100
D59 Vcc LED8 NSCW100
D60 Vcc LED9 NSCW100
D61 Vcc LED10 NSCW100
C7 Vcc 0 220µ
* U7: lm3915 (symbol AutoGenerated\lm3915 not available, pins judged from their places): pin1=LED1 pin2=0 pin3=Vcc pin4=0 pin5=Vi pin6=Vrhi pin7=Vref6 pin8=0 pin9=Vcc pin10=LED2 pin11=LED3 pin12=LED4 pin13=LED5 pin14=LED6 pin15=LED7 pin16=LED8 pin17=LED9 pin18=LED10
R9 Vref6 N001 680
D62 Vcc LED1 NSCW100
D63 Vcc LED2 NSCW100
D64 Vcc LED3 NSCW100
D65 Vcc LED4 NSCW100
D66 Vcc LED5 NSCW100
D67 Vcc LED6 NSCW100
D68 Vcc LED7 NSCW100
D69 Vcc LED8 NSCW100
D70 Vcc LED9 NSCW100
D71 Vcc LED10 NSCW100
C8 Vcc 0 220µ
* U8: lm3915 (symbol AutoGenerated\lm3915 not available, pins judged from their places): pin1=LED1 pin2=0 pin3=Vcc pin4=0 pin5=Vi pin6=Vrhi pin7=Vref7 pin8=0 pin9=Vcc pin10=LED2 pin11=LED3 pin12=LED4 pin13=LED5 pin14=LED6 pin15=LED7 pin16=LED8 pin17=LED9 pin18=LED10
R10 Vref7 N001 680
RadjPot N001 0 0
.model D D
.lib standard.dio
.tran 0.1
* Pot = [0:10kohm],
.lib ADI.lib
.backanno
.end